# Altium schematic sheet RK3566_VO_Interface.SchDoc
size A3; SheetNumber: 6; SheetTotal: 17
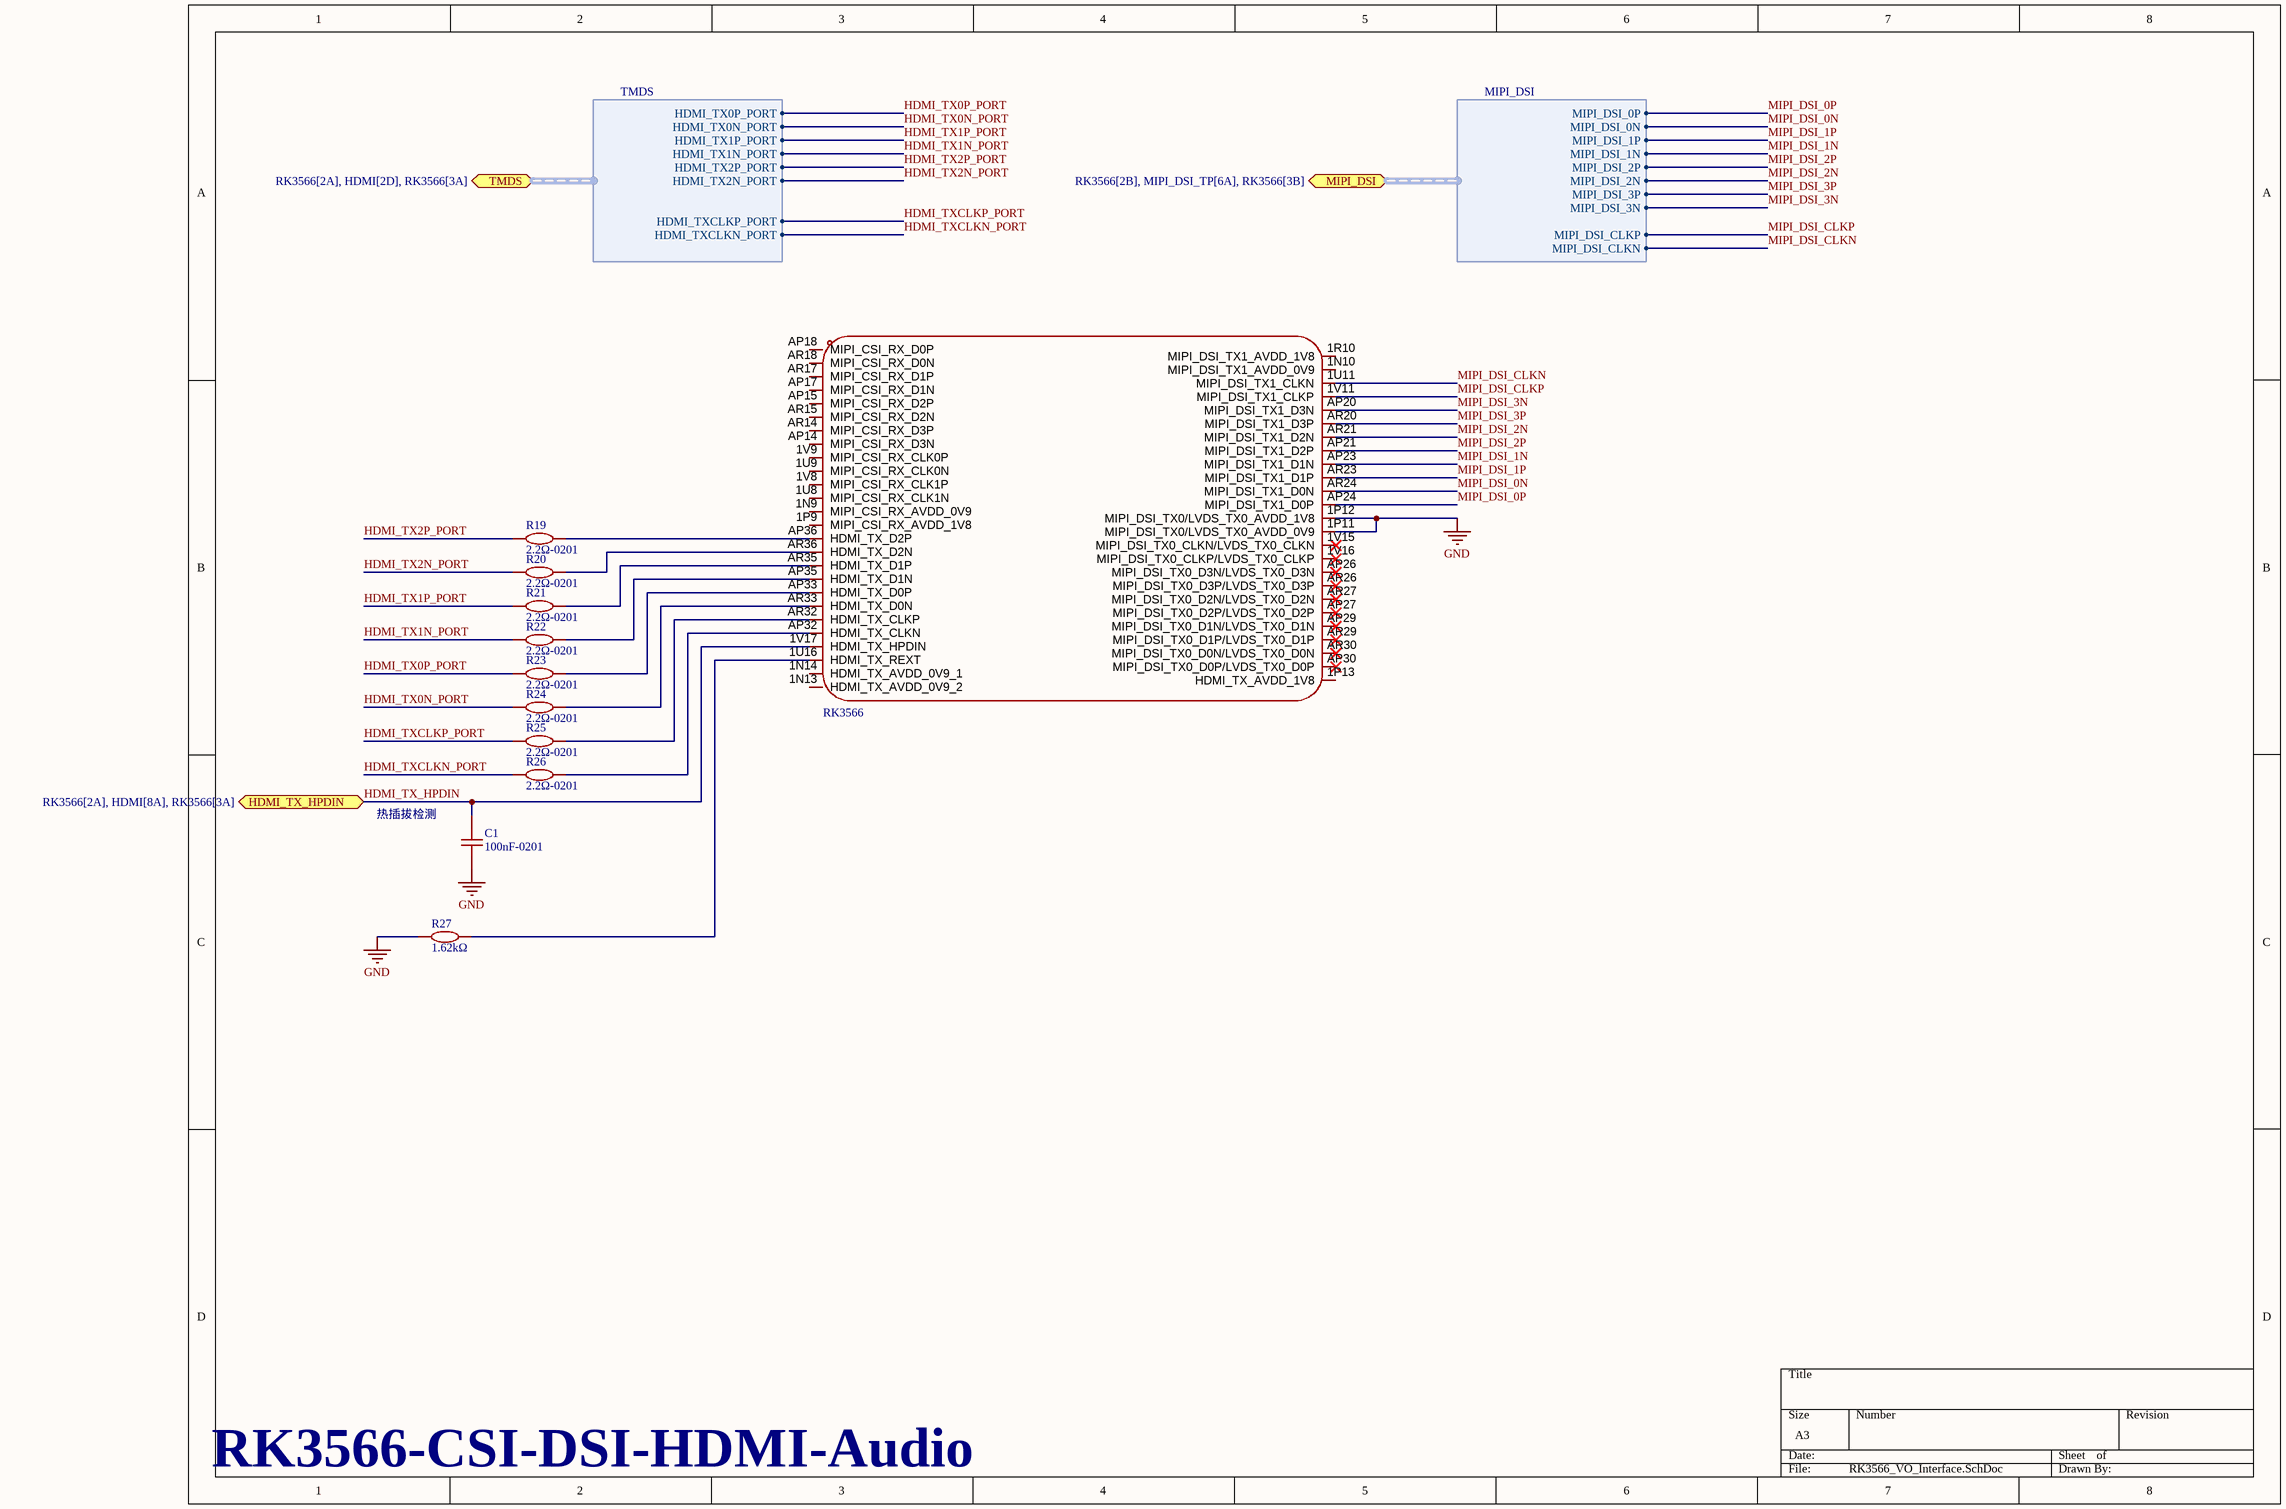
[diagram p0: RK3566_VO_Interface.SchDoc]

## Parts
C1  100nF-0201  [C0402]
R19  2.2Ω-0201  [R0201]
R20  2.2Ω-0201  [R0201]
R21  2.2Ω-0201  [R0201]
R22  2.2Ω-0201  [R0201]
R23  2.2Ω-0201  [R0201]
R24  2.2Ω-0201  [R0201]
R25  2.2Ω-0201  [R0201]
R26  2.2Ω-0201  [R0201]
R27  1.62kΩ  [R0402]
U1  RK3566  [BGA-565_L15.5-W14.4-P0.40_RK3566_1]  (part G of 8)

## Ports
HDMI_TX_HPDIN (bidir, see RK3566[2A], HDMI[8A], RK3566[3A]), MIPI_DSI (bidir, harness MIPI_DSI, see RK3566[2B], MIPI_DSI_TP[6A], RK3566[3B]), TMDS (bidir, harness TMDS, see RK3566[2A], HDMI[2D], RK3566[3A])

## Harnesses
TMDS: HDMI_TX0P_PORT, HDMI_TX0N_PORT, HDMI_TX1P_PORT, HDMI_TX1N_PORT, HDMI_TX2P_PORT, HDMI_TX2N_PORT, HDMI_TXCLKP_PORT, HDMI_TXCLKN_PORT
MIPI_DSI: MIPI_DSI_0P, MIPI_DSI_0N, MIPI_DSI_1P, MIPI_DSI_1N, MIPI_DSI_2P, MIPI_DSI_2N, MIPI_DSI_CLKP, MIPI_DSI_3P, MIPI_DSI_3N, MIPI_DSI_CLKN

## Nets
GND: C1.1 R27.1 U1.1P11(MIPI_DSI_TX0/LVDS_TX0_AVDD_0V9) U1.1P12(MIPI_DSI_TX0/LVDS_TX0_AVDD_1V8)
HDMI_TX0N_PORT: R24.1 ; port TMDS.HDMI_TX0N_PORT
HDMI_TX0P_PORT: R23.1 ; port TMDS.HDMI_TX0P_PORT
HDMI_TX1N_PORT: R22.1 ; port TMDS.HDMI_TX1N_PORT
HDMI_TX1P_PORT: R21.1 ; port TMDS.HDMI_TX1P_PORT
HDMI_TX2N_PORT: R20.1 ; port TMDS.HDMI_TX2N_PORT
HDMI_TX2P_PORT: R19.1 ; port TMDS.HDMI_TX2P_PORT
HDMI_TX_HPDIN: C1.2 U1.1V17(HDMI_TX_HPDIN) ; port HDMI_TX_HPDIN
HDMI_TXCLKN_PORT: R26.1 ; port TMDS.HDMI_TXCLKN_PORT
HDMI_TXCLKP_PORT: R25.1 ; port TMDS.HDMI_TXCLKP_PORT
MIPI_DSI_0N: U1.AR24(MIPI_DSI_TX1_D0N) ; port MIPI_DSI.MIPI_DSI_0N
MIPI_DSI_0P: U1.AP24(MIPI_DSI_TX1_D0P) ; port MIPI_DSI.MIPI_DSI_0P
MIPI_DSI_1N: U1.AP23(MIPI_DSI_TX1_D1N) ; port MIPI_DSI.MIPI_DSI_1N
MIPI_DSI_1P: U1.AR23(MIPI_DSI_TX1_D1P) ; port MIPI_DSI.MIPI_DSI_1P
MIPI_DSI_2N: U1.AR21(MIPI_DSI_TX1_D2N) ; port MIPI_DSI.MIPI_DSI_2N
MIPI_DSI_2P: U1.AP21(MIPI_DSI_TX1_D2P) ; port MIPI_DSI.MIPI_DSI_2P
MIPI_DSI_3N: U1.AP20(MIPI_DSI_TX1_D3N) ; port MIPI_DSI.MIPI_DSI_3N
MIPI_DSI_3P: U1.AR20(MIPI_DSI_TX1_D3P) ; port MIPI_DSI.MIPI_DSI_3P
MIPI_DSI_CLKN: U1.1U11(MIPI_DSI_TX1_CLKN) ; port MIPI_DSI.MIPI_DSI_CLKN
MIPI_DSI_CLKP: U1.1V11(MIPI_DSI_TX1_CLKP) ; port MIPI_DSI.MIPI_DSI_CLKP
NetR19_2: R19.2 U1.AP36(HDMI_TX_D2P)
NetR20_2: R20.2 U1.AR36(HDMI_TX_D2N)
NetR21_2: R21.2 U1.AR35(HDMI_TX_D1P)
NetR22_2: R22.2 U1.AP35(HDMI_TX_D1N)
NetR23_2: R23.2 U1.AP33(HDMI_TX_D0P)
NetR24_2: R24.2 U1.AR33(HDMI_TX_D0N)
NetR25_2: R25.2 U1.AR32(HDMI_TX_CLKP)
NetR26_2: R26.2 U1.AP32(HDMI_TX_CLKN)
NetR27_2: R27.2 U1.1U16(HDMI_TX_REXT)

Not connected (* = marked no-connect by the designer): U1 1N9(MIPI_CSI_RX_AVDD_0V9) 1N10(MIPI_DSI_TX1_AVDD_0V9) 1N13(HDMI_TX_AVDD_0V9_2) 1N14(HDMI_TX_AVDD_0V9_1) 1P9(MIPI_CSI_RX_AVDD_1V8) 1P13(HDMI_TX_AVDD_1V8) 1R10(MIPI_DSI_TX1_AVDD_1V8) 1U8(MIPI_CSI_RX_CLK1N) 1U9(MIPI_CSI_RX_CLK0N) 1V8(MIPI_CSI_RX_CLK1P) 1V9(MIPI_CSI_RX_CLK0P) 1V15(MIPI_DSI_TX0_CLKN/LVDS_TX0_CLKN)* 1V16(MIPI_DSI_TX0_CLKP/LVDS_TX0_CLKP)* AP14(MIPI_CSI_RX_D3N) AP15(MIPI_CSI_RX_D2P) AP17(MIPI_CSI_RX_D1N) AP18(MIPI_CSI_RX_D0P) AP26(MIPI_DSI_TX0_D3N/LVDS_TX0_D3N)* AP27(MIPI_DSI_TX0_D2P/LVDS_TX0_D2P)* AP29(MIPI_DSI_TX0_D1N/LVDS_TX0_D1N)* AP30(MIPI_DSI_TX0_D0P/LVDS_TX0_D0P)* AR14(MIPI_CSI_RX_D3P) AR15(MIPI_CSI_RX_D2N) AR17(MIPI_CSI_RX_D1P) AR18(MIPI_CSI_RX_D0N) AR26(MIPI_DSI_TX0_D3P/LVDS_TX0_D3P)* AR27(MIPI_DSI_TX0_D2N/LVDS_TX0_D2N)* AR29(MIPI_DSI_TX0_D1P/LVDS_TX0_D1P)* AR30(MIPI_DSI_TX0_D0N/LVDS_TX0_D0N)*

## Notes on the sheet
- 热插拔检测
- RK3566-CSI-DSI-HDMI-Audio

## Library data of the parts
C1 = 100nF-0201: CL03A104KO3NNNC
R19-R26 = 2.2Ω-0201: 小尺寸、重量轻。降低组装成本,与贴片机匹配。适用于波峰焊和回流焊
R27 = 1.62kΩ: 特性：无卤环氧树脂。符合RoHS标准。无铅端接产品符合RoHS要求。RoHS豁免电极、电阻元件和玻璃中含有的铅玻璃。减少对环境有害的废物。高组件和设备可靠性。应用：所有通用应用
U1 = RK3566: BGA-565(15.5x14.4); Symbol: RK3566